# EAGLE design 1Sens+lowPass (EAGLE 6.6.0)
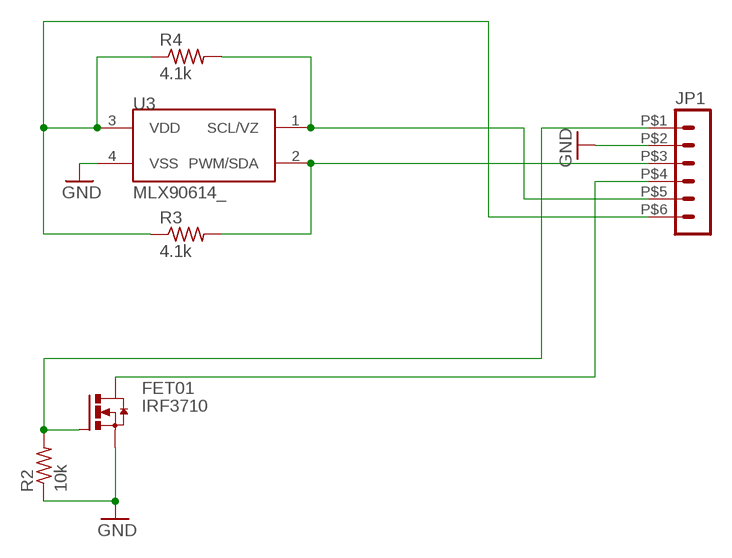
[diagram p0: schematic, sheet 1]

## Parts
FET01  IRF3710  IRF3704  [TO220AH]
JP1  HEADER_POS6_43045-0600  [43045-0600]
R2  10k  R-US_0207/7  [0207/7]
R3  4.1k  R-US_0204/5  [0204/5]
R4  4.1k  R-US_0204/5  [0204/5]
U3  MLX90614_  [TO-39]

## Nets
GND: FET01.E(S) JP1.P$2 R2.1 U3.4(VSS)
N$1: JP1.P$6 R3.1 R4.1 U3.3(VDD)
N$2: FET01.C(D) JP1.P$4
N$15: JP1.P$5 R4.2 U3.1(SCL/VZ)
N$16: JP1.P$3 R3.2 U3.2(PWM/SDA)
N$18: FET01.B(G) JP1.P$1 R2.2

## Library data of the parts
FET01 = transistor-power:IRF3704: SMPS MOSFET HEXFET® Power MOSFET Source: http://www.irf.com/product-info/datasheets/data/irf3704.pdf
JP1 = con-molex-micro-fit-3_0:HEADER_POS6_?: Molex - Micro-Fit 3.0 Series connector, 3.00mm (0.118") pitch header, 6 positions.
R2-R4 = rcl:R-US_: RESISTOR, American symbol
U3 = SparkFun-Sensors:MLX90614: Non-contact PIR I2C interface temperature sensor

## Board
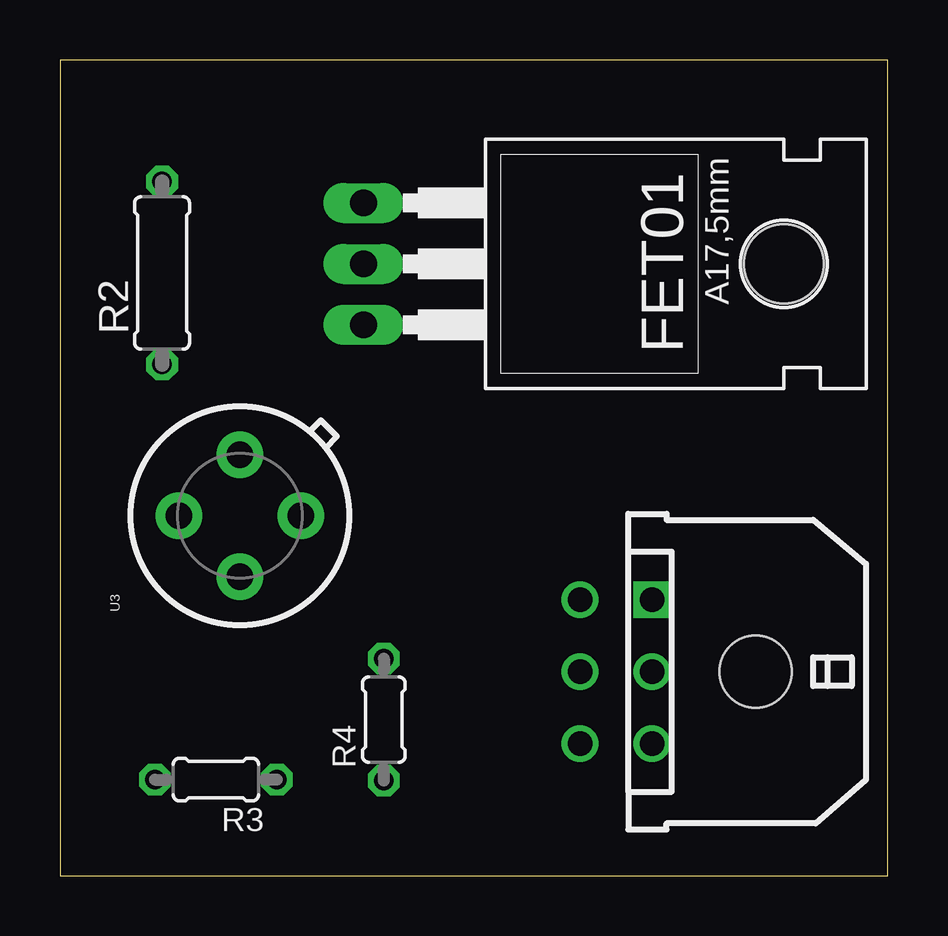
[diagram p1: board, top side]
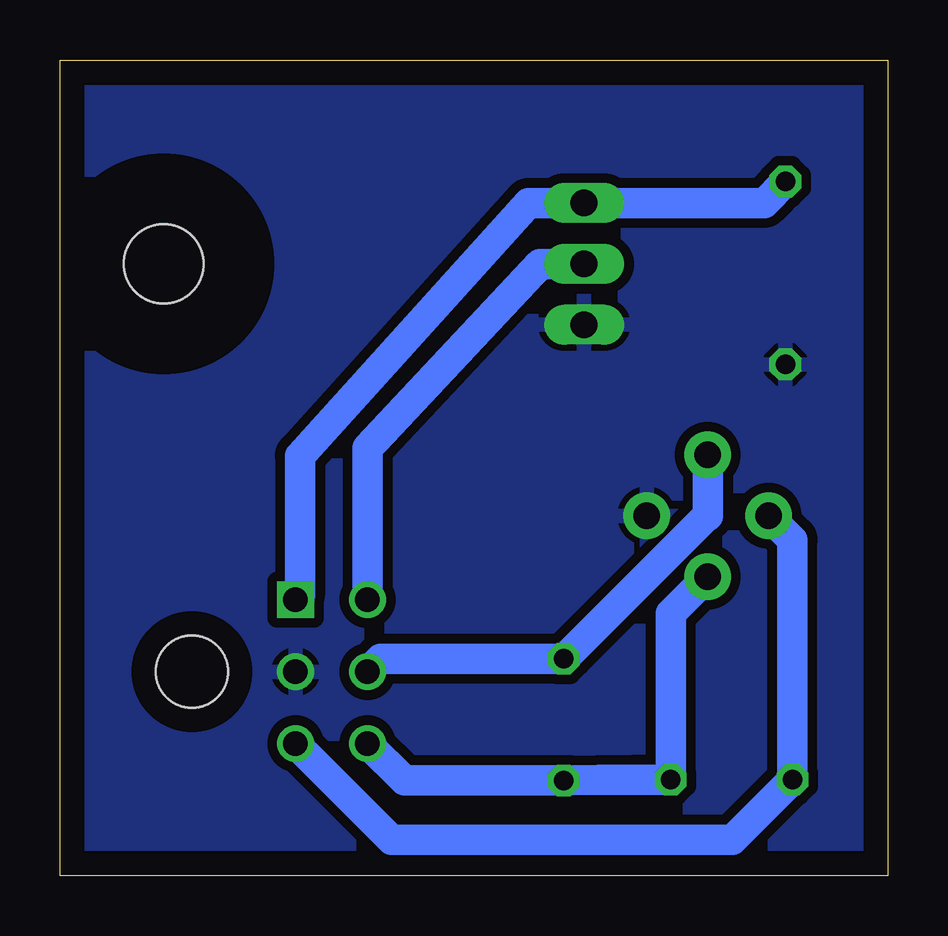
[diagram p2: board, bottom side, seen from below]

Size 34.5 x 34 mm. Coordinates in mm from the lower left corner, seen from the top.
Outline: 0,0 34.5,0 34.5,34 0,34 0,0
Copper layers (1*16): Top 0.035mm / dielectric 1.5mm / Bottom 0.035mm
Design rules "default": minimum track width 10mil, minimum drill 24mil, track to track 8mil, track to pad 8mil, pad to pad 8mil, via to via 8mil, smd to smd 8mil, copper to edge 40mil, drill to drill 8mil, minimum pad ring 10mil, minimum via ring 8mil, stop-mask expansion 4mil, vias tented up to drill 0mil, thermal gap 10mil

### Footprints (pad centres in the part's own frame; a part is rotated, then mirrored left to right if it is on the bottom)
TO220AH = drill 1.118 long: B -2.54,-6.35; C 0,-6.35; E 2.54,-6.35 | hole 3.302: 0,11.176
43045-0600 = drill 1.02 square: P$1 3,4.32 | drill 1.02: P$2 0,4.32; P$3 -3,4.32; P$4 3,7.32; P$5 0,7.32; P$6 -3,7.32 | hole 3: 0,0
0207/7 = drill 0.813 octagon: 1 -3.81,0; 2 3.81,0
0204/5 = drill 0.813 octagon: 1 -2.54,0; 2 2.54,0
TO-39 = drill 1.1 pad 1.93: 1 2.54,0; 2 0,2.54; 3 -2.54,0; 4 0,-2.54

### Placement (x,y rotation side)
FET01  19,25.5 270 top
JP1  29,8.5 90 top
R2  4.26,25.12 90 top
R3  6.5,4 180 top
R4  13.5,6.5 90 top
U3  7.5,15 90 top

### Tracks (layer width: path | path; a pad name or v marks a point on that pad's centre or on a via)
GND
  pour Bottom (isolate 0.406): 0,34 34.5,34 34.5,0 0,0
N$1
  Bottom 1.27: U3.3 9.04,10.92 R3.1 arc-2 R4.1 20.14,3.96 JP1.P$6
N$2
  Bottom 1.27: FET01.C 14.5,25.5 21.68,17.82 JP1.P$4
N$15
  Bottom 0.813: 7.5,15 7.54,15
  Bottom 1.27: U3.1 7.5,15 | 7.54,15 R4.2 21.14,9.04 JP1.P$5
N$16
  Bottom 1.27: U3.2 3.96,14 R3.2 6.46,1.5 20.68,1.5 JP1.P$3
N$18
  Bottom 1.27: R2.2 5.14,28.04 FET01.B 14.96,28.04 24.5,17.5 24.5,11.68 JP1.P$1

### Text on the board
tTEXT: vib | ioio / pin | scl | GND | VCC ioio | SDA